# EAGLE design HydraBus_1_0_Shield_ESP_WROOM_32_v1_1_Rev1 (EAGLE 7.1.0)
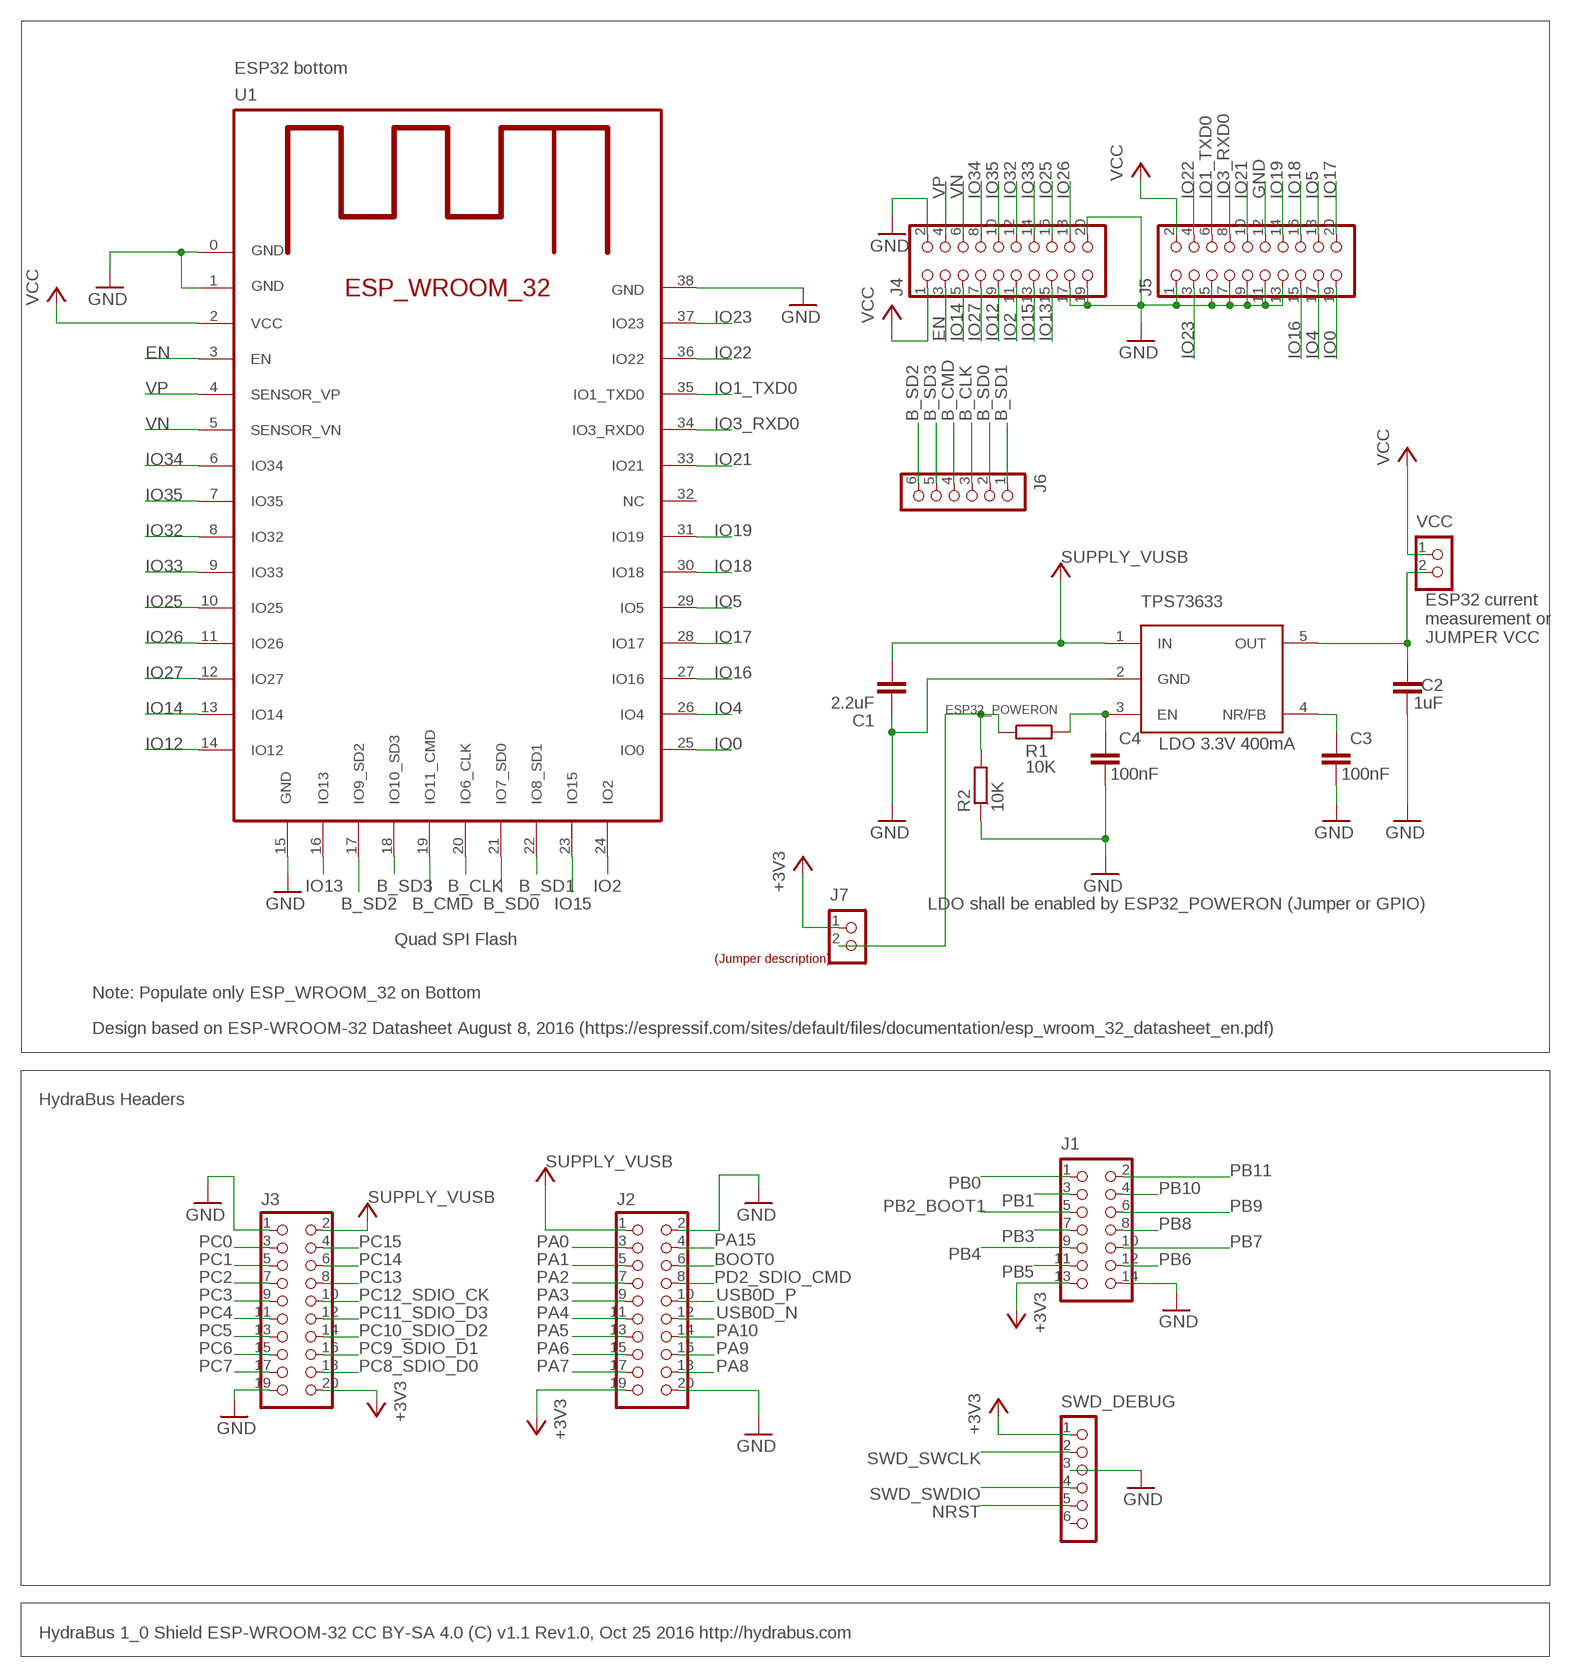
[diagram p0: schematic, sheet 1]

## Parts
C1  2.2uF  CAPACITOR_NPOL-0603  [C603]
C2  1uF  CAPACITOR_NPOL-0603  [C603]
C3  100nF  CAPACITOR_NPOL-0603  [C603]
C4  100nF  CAPACITOR_NPOL-0603  [C603]
J1  HYDRABUS_SHIELD_CON_HEADER_2X07_BOTTOM  [HYDRABUS_SHIELD_M2X7_BOTTOM]
J2  HYDRABUS_SHIELD_CON_HEADER_2X10_BOTTOM  [HYDRABUS_SHIELD_M2X10_BOTTOM]
J3  HYDRABUS_SHIELD_CON_HEADER_2X10_BOTTOM  [HYDRABUS_SHIELD_M2X10_BOTTOM]
J4  HYDRABUS_SHIELD_CON_HEADER_2X10  [HYDRABUS_SHIELD_M2X10]
J5  HYDRABUS_SHIELD_CON_HEADER_2X10  [HYDRABUS_SHIELD_M2X10]
J6  HYDRABUS_SHIELD_CON_HEADER_1X06  [HYDRABUS_SHIELD_M1X6]
J7  CON_HEADER_1X02-PTH  [M1X2]
R1  10K  RESISTOR-0603  [R603]
R2  10K  RESISTOR-0603  [R603]
SWD_DEBUG  HYDRABUS_SHIELD_CON_HEADER_1X06_BOTTOM  [HYDRABUS_SHIELD_M1X6_BOTTOM]
U1  ESP_WROOM_32  [ESP_WROOM_32]
U2  TPS73633  [SOT23-5L]
U$1  LABEL_JUMPER_1X2  [JUMP2_DESC]
VCC  CON_HEADER_1X02-PTH  [M1X2]

## Nets
+3V3 [VDD]: J1.13 J2.19 J3.20 J7.1 SWD_DEBUG.1
B_CLK: J6.3 U1.20(IO6_CLK)
B_CMD: J6.4 U1.19(IO11_CMD)
B_SD0: J6.2 U1.21(IO7_SD0)
B_SD1: J6.1 U1.22(IO8_SD1)
B_SD2: J6.6 U1.17(IO9_SD2)
B_SD3: J6.5 U1.18(IO10_SD3)
BOOT0: J2.6
EN: J4.3 U1.3(EN)
ESP32_POWERON: J7.2 R1.1 R2.2
GND: C1.1 C2.1 C3.1 C4.1 J1.14 J2.2 J2.20 J3.1 J3.19 J4.2 J4.17 J4.19 J4.20 J5.1 J5.5 J5.7 J5.9 J5.11 J5.12 J5.13 R2.1 SWD_DEBUG.3 U1.0(GND) U1.1(GND) U1.15(GND) U1.38(GND) U2.2(GND)
IO0: J5.19 U1.25(IO0)
IO1_TXD0: J5.6 U1.35(IO1_TXD0)
IO2: J4.11 U1.24(IO2)
IO3_RXD0: J5.8 U1.34(IO3_RXD0)
IO4: J5.17 U1.26(IO4)
IO5: J5.18 U1.29(IO5)
IO12: J4.9 U1.14(IO12)
IO13: J4.15 U1.16(IO13)
IO14: J4.5 U1.13(IO14)
IO15: J4.13 U1.23(IO15)
IO16: J5.15 U1.27(IO16)
IO17: J5.20 U1.28(IO17)
IO18: J5.16 U1.30(IO18)
IO19: J5.14 U1.31(IO19)
IO21: J5.10 U1.33(IO21)
IO22: J5.4 U1.36(IO22)
IO23: J5.3 U1.37(IO23)
IO25: J4.16 U1.10(IO25)
IO26: J4.18 U1.11(IO26)
IO27: J4.7 U1.12(IO27)
IO32: J4.12 U1.8(IO32)
IO33: J4.14 U1.9(IO33)
IO34: J4.8 U1.6(IO34)
IO35: J4.10 U1.7(IO35)
N$1: C3.2 U2.4(NR/FB)
N$4: C4.2 R1.2 U2.3(EN)
N$6: C2.2 U2.5(OUT) VCC.2
NRST: SWD_DEBUG.5
PA0: J2.3
PA1: J2.5
PA2: J2.7
PA3: J2.9
PA4: J2.11
PA5: J2.13
PA6: J2.15
PA7: J2.17
PA8: J2.18
PA9: J2.16
PA10: J2.14
PA15: J2.4
PB0: J1.1
PB1: J1.3
PB2_BOOT1: J1.5
PB3: J1.7
PB4: J1.9
PB5: J1.11
PB6: J1.12
PB7: J1.10
PB8: J1.8
PB9: J1.6
PB10: J1.4
PB11: J1.2
PC0: J3.3
PC1: J3.5
PC2: J3.7
PC3: J3.9
PC4: J3.11
PC5: J3.13
PC6: J3.15
PC7: J3.17
PC8_SDIO_D0: J3.18
PC9_SDIO_D1: J3.16
PC10_SDIO_D2: J3.14
PC11_SDIO_D3: J3.12
PC12_SDIO_CK: J3.10
PC13: J3.8
PC14: J3.6
PC15: J3.4
PD2_SDIO_CMD: J2.8
SWD_SWCLK: SWD_DEBUG.2
SWD_SWDIO: SWD_DEBUG.4
USB0D_N: J2.12
USB0D_P: J2.10
VCC: J4.1 J5.2 U1.2(VCC) VCC.1
VN: J4.6 U1.5(SENSOR_VN)
VP: J4.4 U1.4(SENSOR_VP)
VUSB [POWER]: C1.2 J2.1 J3.2 U2.1(IN) ; supply symbol labelled SUPPLY_VUSB
Unconnected: SWD_DEBUG.6 U1.32(NC)

## Notes on the sheet
- ESP32 bottom
- ESP32 current
  measurement or 
  JUMPER VCC
- LDO 3.3V 400mA
- LDO shall be enabled by ESP32_POWERON (Jumper or GPIO)
- Quad SPI Flash
- Note: Populate only ESP_WROOM_32 on Bottom
- Design based on ESP-WROOM-32 Datasheet August 8, 2016 (https://espressif.com/sites/default/files/documentation/esp_wroom_32_datasheet_en.pdf)
- HydraBus Headers
- HydraBus 1_0 Shield ESP-WROOM-32 CC BY-SA 4.0 (C) v1.1 Rev1.0, Oct 25 2016 http://hydrabus.com

## Library data of the parts
C1-C4 = hydrabus:CAPACITOR_NPOL: Non-Polarized capacitor in various packages
J1 = hydrabus_shield:HYDRABUS_SHIELD_CON_HEADER_2X07_BOTTOM: 2x7 Pin header bottom
J2 J3 = hydrabus_shield:HYDRABUS_SHIELD_CON_HEADER_2X10_BOTTOM: 2x10 Pin header bottom
J4 J5 = hydrabus_shield:HYDRABUS_SHIELD_CON_HEADER_2X10: 2x10 Pin header
J6 = hydrabus_shield:HYDRABUS_SHIELD_CON_HEADER_1X06: SWD Header 1x6 Pin header
J7 VCC = hydrabus:CON_HEADER_1X02
R1 R2 = hydrabus:RESISTOR
SWD_DEBUG = hydrabus_shield:HYDRABUS_SHIELD_CON_HEADER_1X06_BOTTOM: SWD Header 1x6 Pin header bottom
U1 = ESP_WROOM_32:ESP_WROOM_32: ESP_WROOM_32 Module 09 Aug 2016 Espressif
U2 = Eagle-Library_TPS73633:TPS73633
U$1 = hydrabus:LABEL_JUMPER_1X2: Nice formatted two legged jumperdescription Use attributes to change the values ON = With jumper OFF = Without jumper; OFF: off; ON: on

## Net classes
0 default: width 0.203 mm, drill 0.33 mm, clearance 0.152 mm
1 POWER: width 0.203 mm, drill 0.33 mm, clearance 0.152 mm
2 VDD: width 0.254 mm, drill 0.33 mm, clearance 0.152 mm

## Board
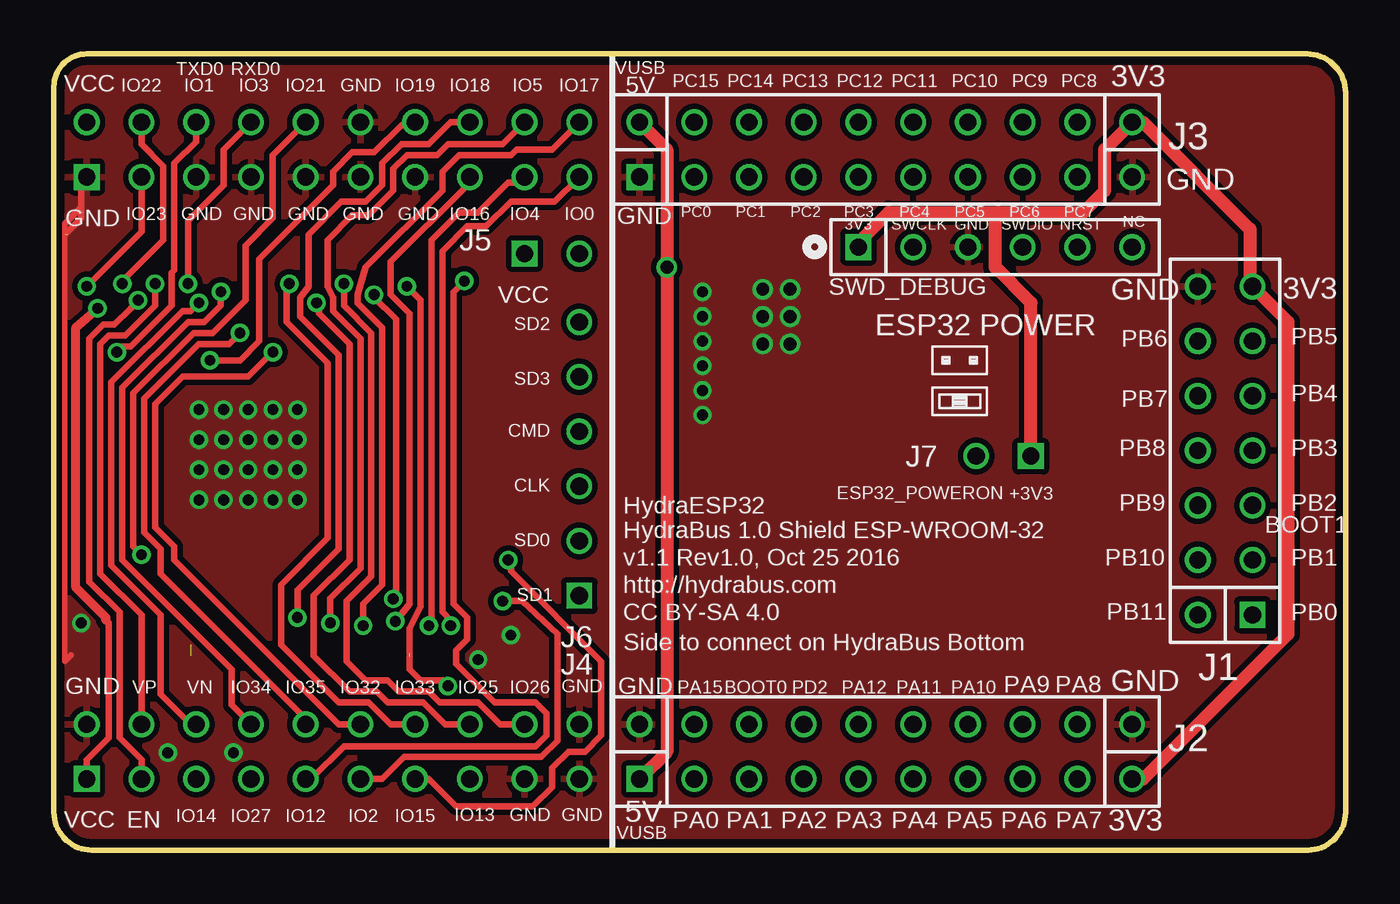
[diagram p1: board, top side]
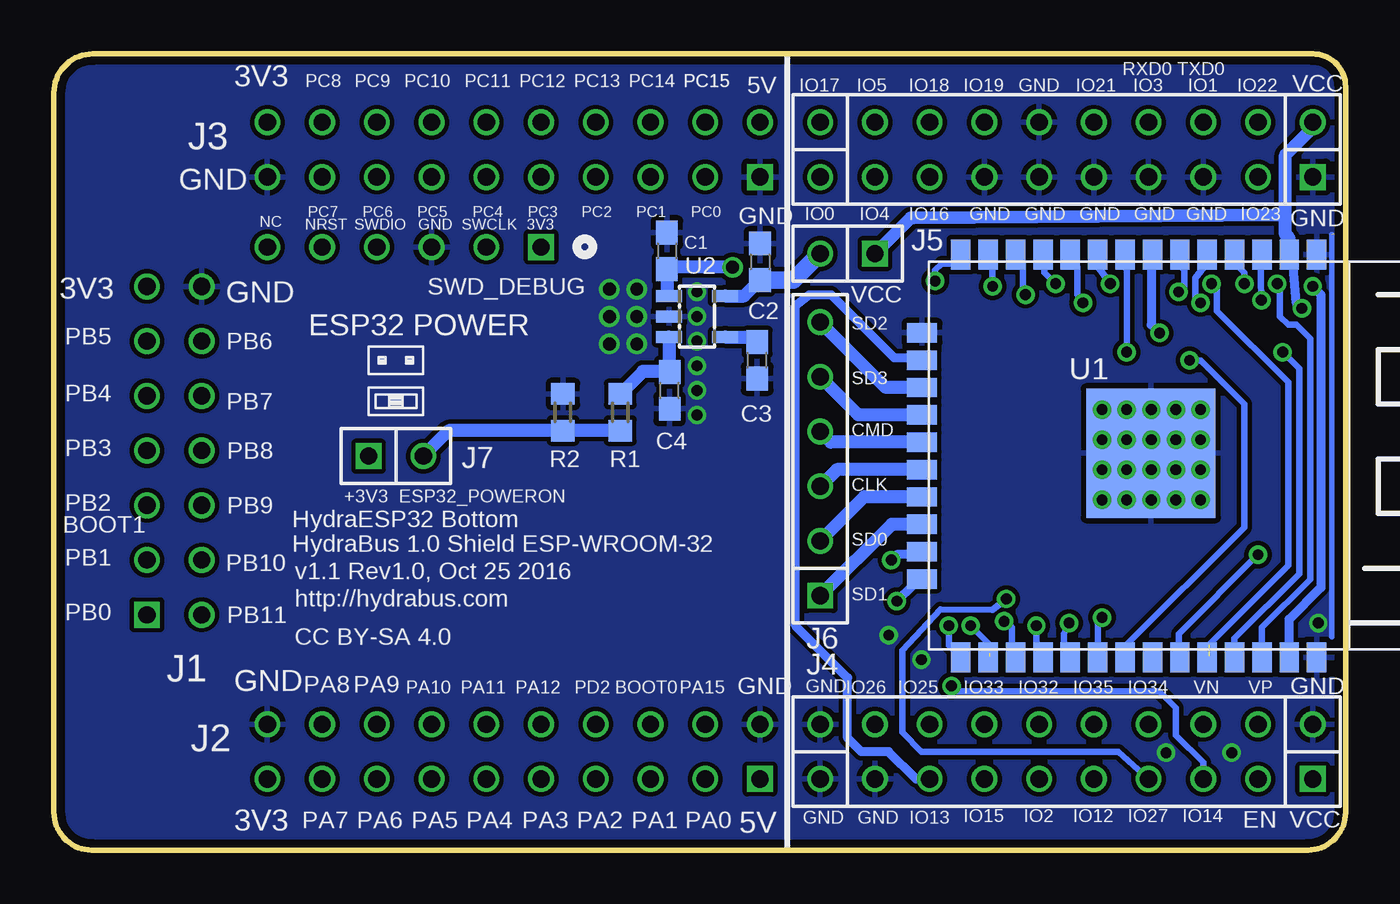
[diagram p2: board, bottom side, seen from below]

Size 59.94 x 36.96 mm. Coordinates in mm from the lower left corner, seen from the top.
Outline: 59.94,35.15 59.94,1.76 arc-90 58.18,0 1.76,0 arc-90 0,1.76 0,35.43 arc-90 1.53,36.96 58.14,36.96 arc-90 59.94,35.15
Copper layers (1*16): Top 0.0356mm / dielectric 1.5011mm / Bottom 0.0356mm
Design rules "oshpark-2layer": minimum track width 6mil, minimum drill 13mil, track to track 6mil, track to pad 6mil, pad to pad 6mil, via to via 6mil, smd to smd 6mil, copper to edge 15mil, drill to drill 6mil, minimum pad ring 7mil, minimum via ring 7mil, stop-mask expansion 2.5mil, vias tented up to drill 0mil, thermal gap 10mil

### Footprints (pad centres in the part's own frame; a part is rotated, then mirrored left to right if it is on the bottom)
C603 = smd 1.1 x 1: 1 -0.85,0; 2 0.85,0
HYDRABUS_SHIELD_M2X7_BOTTOM = drill 0.8 square: 1 -7.62,-1.27 | drill 0.8: 2 -7.62,1.27; 3 -5.08,-1.27; 4 -5.08,1.27; 5 -2.54,-1.27; 6 -2.54,1.27; 7 0,-1.27; 8 0,1.27; 9 2.54,-1.27; 10 2.54,1.27; 11 5.08,-1.27; 12 5.08,1.27; 13 7.62,-1.27; 14 7.62,1.27
HYDRABUS_SHIELD_M2X10_BOTTOM = drill 0.8 square: 1 -11.43,-1.27 | drill 0.8: 2 -11.43,1.27; 3 -8.89,-1.27; 4 -8.89,1.27; 5 -6.35,-1.27; 6 -6.35,1.27; 7 -3.81,-1.27; 8 -3.81,1.27; 9 -1.27,-1.27; 10 -1.27,1.27; 11 1.27,-1.27; 12 1.27,1.27; 13 3.81,-1.27; 14 3.81,1.27; 15 6.35,-1.27; 16 6.35,1.27; 17 8.89,-1.27; 18 8.89,1.27; 19 11.43,-1.27; 20 11.43,1.27
HYDRABUS_SHIELD_M2X10 = drill 0.8 square: 1 -11.43,-1.27 | drill 0.8: 2 -11.43,1.27; 3 -8.89,-1.27; 4 -8.89,1.27; 5 -6.35,-1.27; 6 -6.35,1.27; 7 -3.81,-1.27; 8 -3.81,1.27; 9 -1.27,-1.27; 10 -1.27,1.27; 11 1.27,-1.27; 12 1.27,1.27; 13 3.81,-1.27; 14 3.81,1.27; 15 6.35,-1.27; 16 6.35,1.27; 17 8.89,-1.27; 18 8.89,1.27; 19 11.43,-1.27; 20 11.43,1.27
HYDRABUS_SHIELD_M1X6 = drill 0.8 square: 1 0,0 | drill 0.8: 2 2.54,0; 3 5.08,0; 4 7.62,0; 5 10.16,0; 6 12.7,0
M1X2 = drill 0.8 square: 1 -1.27,0 | drill 0.8: 2 1.27,0
R603 = smd 1 x 1.1: 1 -0.85,0; 2 0.85,0
HYDRABUS_SHIELD_M1X6_BOTTOM = drill 0.8 square: 1 0,0 | drill 0.8: 2 2.54,0; 3 5.08,0; 4 7.62,0; 5 10.16,0; 6 12.7,0
ESP_WROOM_32 = smd 6 x 6: 0 9.9,12.3 | smd 1.4 x 0.9: 1 0.68,19.99; 2 0.68,18.72; 3 0.68,17.45; 4 0.68,16.18; 5 0.68,14.91; 6 0.68,13.64; 7 0.68,12.37; 8 0.68,11.1; 9 0.68,9.83; 10 0.68,8.56; 11 0.68,7.29; 12 0.68,6.02; 13 0.68,4.75; 14 0.68,3.48; 25 19.38,3.48; 26 19.38,4.75; 27 19.38,6.02; 28 19.38,7.29; 29 19.38,8.56; 30 19.38,9.83; 31 19.38,11.1; 32 19.38,12.37; 33 19.38,13.64; 34 19.38,14.91; 35 19.38,16.18; 36 19.38,17.45; 37 19.38,18.72; 38 19.38,19.99 | smd 0.9 x 1.4: 15 4.31,1.68; 16 5.58,1.68; 17 6.85,1.68; 18 8.12,1.68; 19 9.39,1.68; 20 10.66,1.68; 21 11.93,1.68; 22 13.2,1.68; 23 14.47,1.68; 24 15.74,1.68
SOT23-5L = smd 0.55 x 1.2: 1 -0.95,-1.3; 2 0,-1.3; 3 0.95,-1.3; 4 0.95,1.3; 5 -0.95,1.3

### Placement (x,y rotation side)
C1  31.5,27.81 270 bottom
C2  27.18,27.3 270 bottom
C3  27.3,22.73 90 bottom
C4  31.37,21.34 90 bottom
J1  54.36,18.54 90 top
J2  38.61,4.57 0 top
J3  38.61,32.51 0 top
J4  12.95,4.57 0 top
J5  12.95,32.51 0 top
J6  24.38,11.81 90 top
J7  44.07,18.29 0 bottom
R1  33.66,20.32 90 bottom
R2  36.32,20.32 270 bottom
SWD_DEBUG  37.34,27.99 0 top
U1  21.34,28.32 270 bottom
U2  30.1,24.77 270 bottom
U$1  41.53,21.46 0 bottom
U$2  LABEL_JUMPER_1X2  [JUMP2_DESC]  44.58,21.46 0 top
VCC  23.11,27.69 180 bottom

### Tracks (layer width: path | path; a pad name or v marks a point on that pad's centre or on a via)
+3V3
  Top 0.406: SWD_DEBUG.1 37.34,28.19 | 55.5,26.29 J1.13
  Top 0.61: J1.13 57.28,24.51 57.28,10.03 50.55,3.3 J2.19 | 37.34,28.19 38.73,29.59 43.81,29.59 | 43.81,29.59 47.75,29.59 48.77,30.61 48.77,32.51 J3.20 50.55,33.78 55.5,28.83 55.5,26.29 | J7.1 45.34,25.4 43.69,27.05 43.69,29.46 43.81,29.59
B_CLK
  Bottom 0.61: U1.20 23.61,17.66 J6.3
B_CMD
  Bottom 0.61: U1.19 23.88,18.93 J6.4
B_SD0
  Bottom 0.61: U1.21 22.34,16.39 J6.2
B_SD1
  Bottom 0.61: U1.22 21.07,15.12 J6.1
B_SD2
  Bottom 0.61: U1.17 21.34,21.47 J6.6
B_SD3
  Bottom 0.61: U1.18 22.61,20.2 J6.5
EN  (via drill 0.5)
  Top 0.305: J4.3 4.06,4.19 3.05,5.21 3.05,11.05 1.65,12.45 1.65,23.75 2.29,24.38 2.79,24.38 3.56,25.15 3.81,25.43 v3.91,25.53
  Bottom 0.305: 4.19,27.34 3.94,27.59 | 3.94,27.59 U1.3 | 3.94,27.59 3.94,26.54 v3.91,25.53
ESP32_POWERON
  Bottom 0.61: R1.1 R2.2 41.62,19.47 J7.2
GND  (via drill 0.5, 0.6)  (1 unrouted)
  Top 0.254: 0.81,9.06 0.51,8.76 0.51,29.08 1.27,29.84
  Top 0.305: 0.53,28.6 1.27,29.34 1.27,29.84 1.27,30.99 J5.1
  Bottom 0.254: 0.64,9.91 0.64,28.57
  Bottom 0.406: v6.73,20.45 v7.87,20.45 v7.87,19.05 | v7.87,19.05 v7.87,17.65 | v9.02,16.26 7.87,17.4 v7.87,17.65 | v11.3,20.45 v10.16,20.45 v9.02,20.45 | v11.3,19.05 11.43,19.18 11.43,19.05 | 11.43,19.05 11.43,16.38 v11.3,16.26 11.18,16.38 10.79,16.38 10.67,16.26 10.41,16.26 | v11.3,19.05 11.43,19.05 | v7.87,19.05 v10.16,19.05 v11.3,19.05 | v6.73,17.65 v7.87,17.65 | v7.87,17.65 v9.02,17.65 | v9.02,17.65 v10.16,17.65 v11.3,17.65 | v10.16,16.26 v7.87,16.26 v6.73,16.26 | v10.16,16.26 10.41,16.26 | 10.41,16.26 v9.02,17.65 | v10.16,16.26 10.16,15.88 | v6.73,17.65 v6.73,19.05 v7.87,19.05 | 6.86,17.53 v6.73,17.65
  other vias: 9.02,19.05 5.28,4.52 8.33,4.52 1.27,10.54 19.68,8.84 30.1,24.77 32.89,24.77 32.89,26.04 30.1,25.91 30.1,23.62 32.89,23.5 34.16,26.04 34.16,24.77 34.16,23.5 30.1,22.48 30.1,21.34 30.1,20.19 21.21,9.98
  pour Top (isolate 0.254): -1,38.22 60.84,38.22 60.84,-1 -1,-1
  pour Bottom (isolate 0.203): -2.02,39.86 62.13,39.86 62,-2 -2,-2.25
IO0  (via drill 0.5)
  Top 0.305: v18.41,10.41 18.41,10.67 18.03,11.05 18.03,27.81 19.18,28.96 20.07,28.96 21.21,30.1 23.24,30.1 J5.19
  Bottom 0.305: v18.41,10.41 18.41,9.5 U1.25
IO1_TXD0  (via drill 0.5)
  Top 0.305: v2.92,23.11 3.17,23.37 3.56,23.37 5.46,25.27 5.46,26.8 5.59,26.92 5.59,31.88 6.6,32.89 J5.6
  Bottom 0.305: U1.35 5.16,9.83 2.16,12.83 2.16,22.35 v2.92,23.11
IO2  (via drill 0.5)
  Top 0.305: J4.11 15.24,3.3 16.26,4.32 22.61,4.32 23.37,5.08 23.37,10.03 21.72,11.56 v20.83,11.56
  Bottom 0.406: U1.24 19.79,12.45 19.81,12.45 19.92,12.32 20.07,12.32 v20.83,11.56
IO3_RXD0  (via drill 0.5)  (1 unrouted)
  Top 0.305: J5.8 7.87,32.51 7.87,30.86 6.22,29.21 v6.22,26.29
  Bottom 0.305: v6.22,26.29 5.97,26.16 5.97,25.02 2.67,21.72 2.67,13.21 6.35,9.53 | 6.35,9.02 U1.34
IO4  (via drill 0.5)
  Top 0.305: v17.4,10.41 17.53,10.54 17.53,28.32 18.8,29.59 19.68,29.59 21.08,30.99 21.59,30.99 J5.17
  Bottom 0.254: 16.38,9.14 U1.26
  Bottom 0.305: 16.38,9.14 16.51,9.14 16.51,9.53 v17.4,10.41
IO5  (via drill 0.5)
  Top 0.305: v12.83,10.54 12.83,11.68 14.22,13.08 14.22,23.75 12.95,25.02 12.95,25.65 12.7,26.16 12.7,28.32 13.84,29.46 14.61,29.46 15.75,30.61 15.75,31.62 16.38,32.26 17.78,32.26 18.29,32.77 20.83,32.77 J5.18
  Bottom 0.305: U1.29 12.78,9.35 13.08,9.65 13.08,10.03 v12.83,10.54
IO12  (via drill 0.5)
  Top 0.305: J4.9 11.94,3.3 13.46,4.83 22.35,4.83 22.86,5.33 22.86,6.35 22.35,6.86 20.45,6.86 18.67,8.64 18.67,9.27 19.18,9.78 19.18,10.79 18.54,11.43 18.54,25.91 v19.05,26.42
  Bottom 0.305: U1.14 17.86,27.23 18.75,27.23 19.05,26.92 v19.05,26.42
IO13
  Bottom 0.406: J4.15 19.94,3.3 21.21,4.57 22.48,4.57 23.11,5.21 23.11,8 25.53,10.41 25.53,25.27 24.89,25.78 23.88,25.78 20.95,22.86 19.77,22.86 U1.16
IO14  (via drill 0.5)  (1 unrouted)
  Top 0.305: v18.29,7.62 18.03,7.87 17.02,7.87 16.51,8.38 16.51,8.99 | 16.51,9.14 16.51,10.29 17.02,11.3 17.02,25.53 v16.38,26.16
  Bottom 0.305: J4.5 6.6,4.06 7.87,5.33 7.87,6.6 8.64,7.37 18.16,7.37 v18.29,7.62 | 16.89,27.34 U1.13 16.38,27.44 v16.38,26.16
IO15  (via drill 0.5)
  Top 0.305: J4.13 17.4,3.3 18.67,2.03 22.23,2.03 23.11,2.92 23.11,3.81 23.88,4.57 24.64,4.57 25.4,5.33 25.4,8.76 21.21,12.95 21.21,13.34 v21.08,13.46
  Bottom 0.406: U1.23 19.79,13.72 20.83,13.72 v21.08,13.46
IO16  (via drill 0.5)
  Top 0.305: v15.85,10.62 16.51,11.43 16.51,24.89 15.62,25.78 15.62,27.3 19.05,30.73 19.05,30.99 J5.15
  Bottom 0.305: v15.85,10.62 15.49,10.34 15.49,9.25 U1.27
IO17  (via drill 0.5)
  Top 0.305: J5.20 23.11,32.51 21.46,32.51 21.21,32.26 18.8,32.26 18.03,31.5 18.03,30.61 14.48,27.05 14.35,26.67 14.1,25.78 14.1,25.4 15.24,24.26 15.24,12.32 14.35,11.43 v14.35,10.41
  Bottom 0.305: U1.28 14.05,9.35 14.35,9.65 v14.35,10.41
IO18  (via drill 0.5)
  Top 0.305: J5.16 18.41,33.78 17.4,32.77 16.13,32.77 15.24,31.88 15.24,30.86 14.48,30.1 13.34,30.1 11.81,28.57 11.81,26.16 11.43,25.65 11.43,24.77 13.21,22.99 13.21,13.97 11.3,12.06 v11.3,10.79
  Bottom 0.305: 11.43,8.76 11.51,8.84 U1.30 11.51,10.46 v11.3,10.79
IO19  (via drill 0.5)
  Top 0.305: v7.24,22.73 8.64,22.73 9.53,23.62 9.53,27.43 12.95,30.86 12.95,31.5 13.84,32.38 14.86,32.38 16.13,33.66 16.64,33.66 J5.14
  Bottom 0.305: U1.31 10.24,9.45 4.7,14.99 4.7,20.7 6.73,22.73 v7.24,22.73
IO21  (via drill 0.5)
  Top 0.305: v4.06,13.72 3.68,14.1 3.68,21.21 6.48,24 7.37,24 8.89,25.53 8.89,28.07 10.16,29.34 10.16,32.26 J5.10
  Bottom 0.305: U1.33 7.7,9.45 7.75,9.5 7.75,10.03 v4.06,13.72
IO22  (via drill 0.5)
  Top 0.305: v3.17,26.29 3.17,26.42 5.08,28.32 5.08,31.75 4.06,32.77 J5.4
  Bottom 0.305: U1.36 3.89,10.34 1.65,12.57 1.65,23.75 2.29,24.38 2.67,24.38 3.05,24.77 3.05,26.16 v3.17,26.29
IO23  (via drill 0.5)
  Top 0.305: v1.52,26.16 4.06,28.7 J5.3
  Bottom 0.305: U1.37 2.62,9.32
  Bottom 0.406: 2.62,9.32 2.62,10.72 1.14,12.19 1.14,25.78 v1.52,26.16
IO25  (via drill 0.5)
  Top 0.305: J4.16 18.16,5.84 17.14,6.86 15.49,6.86 14.99,7.37 13.72,7.37 12.06,9.02 12.06,11.81 13.72,13.46 13.72,23.5 12.32,24.89 12.32,25.27 v12.19,25.4
  Bottom 0.305: U1.10 12.83,27.59 12.83,27.43 12.45,27.05 12.45,25.78 v12.19,25.4
IO26  (via drill 0.5)
  Top 0.305: J4.18 20.7,5.84 19.68,6.86 17.91,6.86 17.4,7.37 16,7.37 15.49,7.87 14.48,7.87 13.59,8.76 13.59,11.56 14.73,12.7 14.73,24 13.46,25.27 v13.46,26.29
  Bottom 0.305: U1.11 13.97,27.57 13.97,26.8 v13.46,26.29
IO27  (via drill 0.5)
  Top 0.305: v14.86,25.78 14.86,25.65 15.88,24.64 15.88,11.79 v15.75,11.66
  Bottom 0.305: U1.12 14.99,27.31 14.99,25.91 v14.86,25.78 | J4.7 10.54,4.57 19.68,4.57 20.57,5.46 20.57,9.27 18.8,11.18 16.38,11.15 v15.75,11.66
IO32  (via drill 0.5)
  Top 0.305: v10.16,23.11 9.02,21.97 5.97,21.97 4.7,20.7 4.7,14.99 5.59,14.1 5.59,13.46 13.21,5.84 J4.12
  Bottom 0.305: U1.8 10.29,27.59 10.29,27.18 10.16,26.92 v10.16,23.11
IO33  (via drill 0.5)
  Top 0.305: J4.14 15.62,5.84 14.61,6.86 13.21,6.86 10.54,9.53 10.54,12.32 12.7,14.48 12.7,22.61 10.79,24.51 10.79,26.16 v10.92,26.29
  Bottom 0.305: U1.9 11.56,27.59 11.56,27.18 v10.92,26.29
IO34  (via drill 0.5)
  Top 0.305: v7.75,25.91 7.75,25.27 6.99,24.51 6.22,24.51 3.17,21.46 3.17,13.46 8.26,8.38 8.26,6.73 J4.8
  Bottom 0.305: U1.6 7.62,27.57 7.62,27.05 7.49,26.92 7.49,26.16 v7.75,25.91
IO35  (via drill 0.5)
  Top 0.305: v8.64,24 8.13,23.5 6.73,23.5 4.19,20.95 4.19,14.73 4.95,13.97 4.95,12.83 11.68,6.1 J4.10
  Bottom 0.305: 9.02,27.59 U1.7
  Bottom 0.406: 9.02,27.59 9.02,24.38 v8.64,24
N$1
  Bottom 0.61: U2.4 27.54,23.82 C3.2
N$4
  Bottom 0.61: U2.3 31.4,22.22 | 31.4,22.22 C4.2 | 31.4,22.22 32.61,22.22 R1.2
N$6
  Bottom 0.61: U2.5 27.92,25.71 C2.2
  Bottom 0.813: C2.2 25.61,26.45 VCC.2
VCC  (via drill 0.5)
  Top 0.305: J4.1 1.52,4.19 2.54,5.21 2.54,10.54 2.41,10.67
  Top 0.406: 2.41,10.67 2.41,10.79 1.02,12.19 1.02,24.26 v2.03,25.15
  Bottom 0.406: v2.03,25.15 2.16,25.15 2.29,25.4 2.41,26.8 2.41,27.44 U1.2
  Bottom 0.61: J5.2 1.52,33.53 2.79,32.26 2.79,29.46 | U1.2 2.62,28.4 2.79,28.57 2.79,29.46 | 2.79,29.46 20.07,29.34 20.19,29.34 VCC.1
VN  (via drill 0.5)
  Top 0.305: v6.73,25.4 6.35,25.02 5.97,25.02 2.67,21.72 2.67,13.21 4.95,10.92 4.95,7.24 6.35,5.84 J4.6
  Bottom 0.305: 6.6,27.46 U1.5 6.48,27.59 6.48,27.18 6.99,26.54 6.99,25.65 v6.73,25.4
VP  (via drill 0.5)
  Top 0.305: v4.7,26.29 4.7,25.27 3.3,23.88 2.54,23.88 2.16,23.5 2.16,12.83 4.06,10.92 J4.4
  Bottom 0.305: v4.7,26.29 4.7,26.8 5.08,27.18 5.21,27.59 U1.4
VUSB  (via drill 0.6)
  Top 0.61: J3.2 28.45,32.51 v28.45,27.05 28.45,4.57 J2.1
  Bottom 0.61: U2.1 31.5,25.81 C1.2 31.41,27.05 v28.45,27.05

### Text on the board
tNames: VUSB | TXD0 | RXD0 | VCC | IO22 | IO1 | IO3 | IO21 | GND | IO19 | IO18 | IO5 | IO17 | 5V | PC15 | PC14 | PC13 | PC12 | PC11 | PC10 | PC9 | PC8 | 3V3 | J3 | GND | GND | IO23 | GND | GND | GND | GND | GND | IO16 | IO4 | IO0 | GND | PC0 | PC1 | PC2 | PC3 | 3V3 | SWCLK | PC4 | GND | PC5 | SWDIO | PC6 | NRST | PC7 | NC | J5 | GND | 3V3 | VCC | SD2 | ESP32 POWER | PB6 | PB5 | SD3 | PB7 | PB4 | CMD | J7 | PB8 | PB3 | CLK | ESP32_POWERON | HydraESP32 | +3V3 | PB9 | PB2 | SD0 | BOOT1 | HydraBus 1.0 Shield ESP-WROOM-32 | v1.1 Rev1.0, Oct 25 2016 | PB10 | PB1 | SD1 | http://hydrabus.com | CC BY-SA 4.0 | PB11 | PB0 | J6 | Side to connect on HydraBus Bottom | J4 | PA15 | BOOT0 | PD2 | PA12 | PA11 | PA10 | PA9 | PA8 | J1 | GND | VP | VN | IO34 | IO35 | IO32 | IO33 | IO25 | IO26 | GND | GND | GND | J2 | VCC | EN | IO14 | IO27 | IO12 | IO2 | IO15 | IO13 | GND | GND | 5V | VUSB | PA0 | PA1 | PA2 | PA3 | PA4 | PA5 | PA6 | PA7 | 3V3
bNames: TXD0 | RXD0 | PC15 | PC15 | PC14 | PC13 | PC12 | PC11 | PC10 | PC9 | PC8 | VCC | IO22 | IO1 | IO3 | IO21 | GND | IO19 | IO18 | IO5 | IO17 | 5V | 3V3 | GND | PC0 | PC1 | PC2 | PC3 | PC4 | PC5 | PC6 | PC7 | GND | IO23 | GND | GND | GND | GND | GND | IO16 | IO4 | IO0 | GND | 3V3 | SWCLK | GND | SWDIO | NRST | NC | SWD_DEBUG | 3V3 | GND | SD2 | ESP32 POWER | PB6 | PB5 | SD3 | PB4 | PB7 | CMD | PB8 | PB3 | CLK | ESP32_POWERON | +3V3 | PB9 | PB2 | HydraESP32 Bottom | BOOT1 | SD0 | HydraBus 1.0 Shield ESP-WROOM-32 | v1.1 Rev1.0, Oct 25 2016 | PB10 | PB1 | SD1 | http://hydrabus.com | PB11 | PB0 | CC BY-SA 4.0 | PA8 | GND | VP | VN | IO34 | IO35 | IO32 | IO33 | IO25 | IO26 | GND | GND | PA15 | BOOT0 | PD2 | PA12 | PA11 | PA10 | PA9 | GND | PA0 | PA1 | PA2 | PA3 | PA4 | PA5 | PA6 | PA7 | VCC | EN | IO14 | IO27 | IO12 | IO2 | IO15 | IO13 | GND | GND | 5V | 3V3